# Altium project Parachute deploy board.PrjPcb
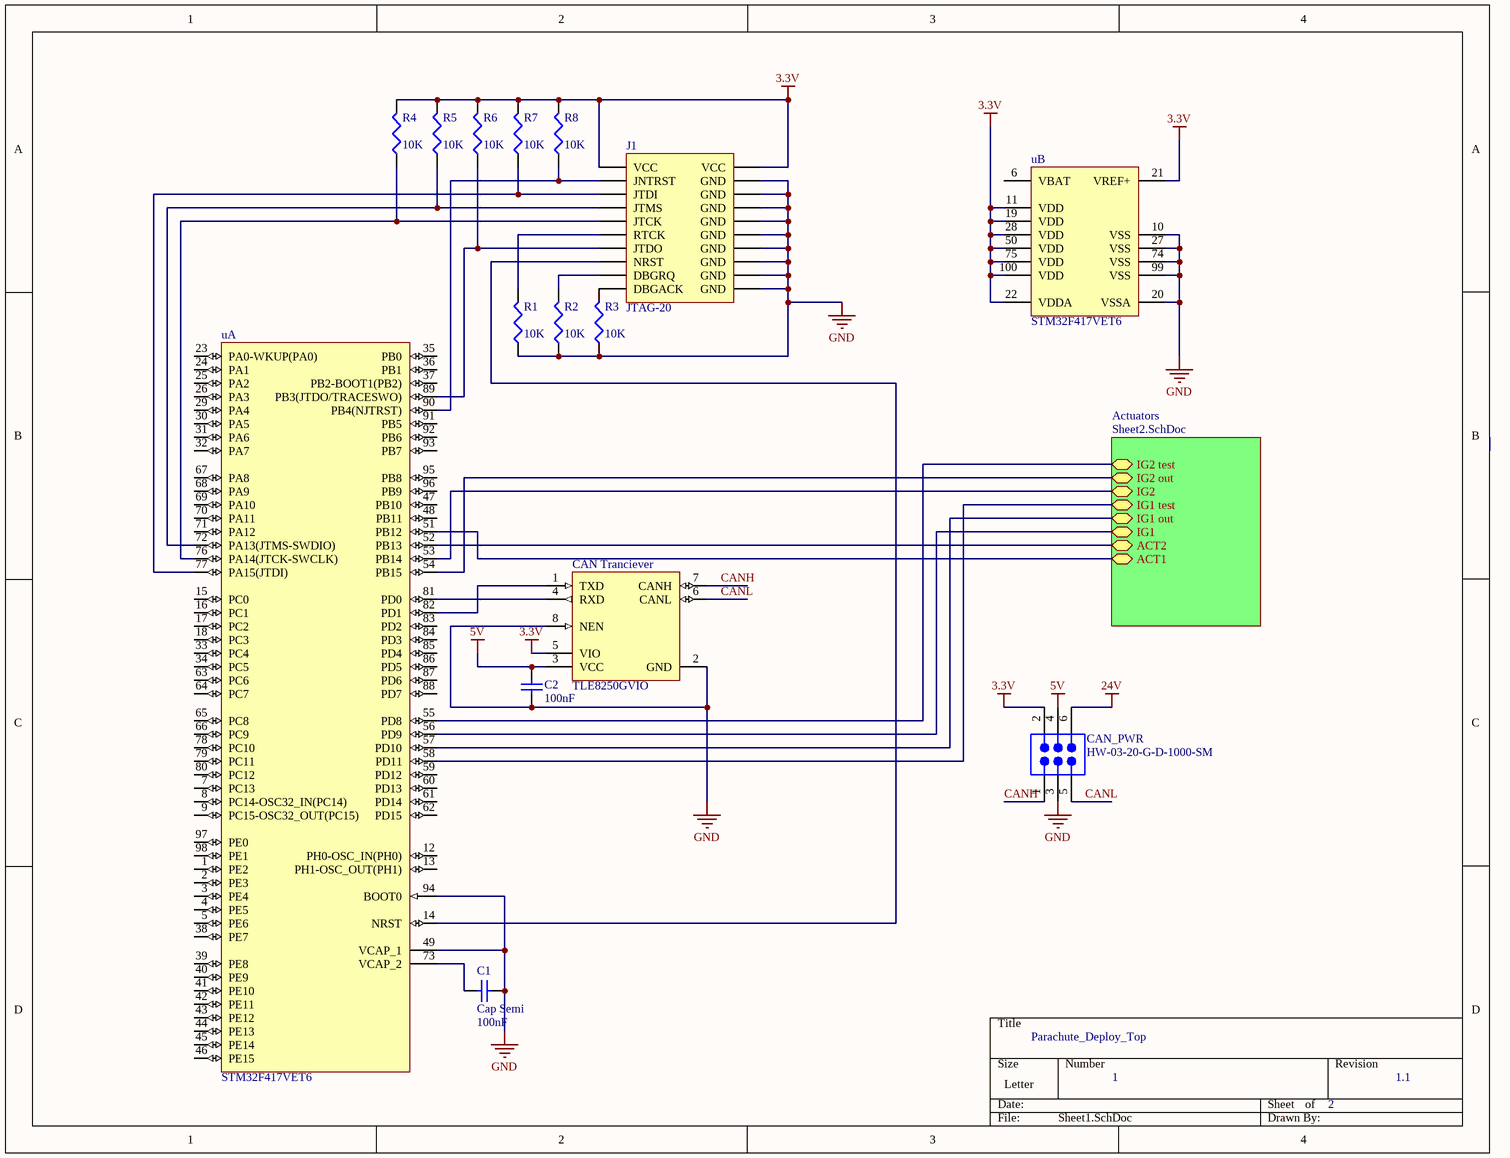
[diagram p0: Sheet1.SchDoc]
2 sheets, 48 parts. Net scope: hierarchical (ports join the sheet entries above them; power ports are global).
Board file: Deploy.PcbDoc
Sheets:
  Sheet1.SchDoc
    Actuators = Sheet2.SchDoc

## Sheet Sheet1.SchDoc: Parachute_Deploy_Top
size Letter; Revision: 1.1; SheetNumber: 1; SheetTotal: 2

### Parts
C1  Cap Semi  value 100nF  [C1206]
C2  value 100nF  [C1206]  (hidden comment: Cap Semi)
CAN_PWR  HW-03-20-G-D-1000-SM  [SMTC-HW-03-20-X-D-1000-SM]
CAN_Tranciever  TLE8250GVIO  [INF-PG-DSO-8-16_N]
J1  JTAG-20  [PCBComponent_1]
R1  value 10K  [J1-0603]  (hidden comment: RTCK PD)
R2  value 10K  [J1-0603]  (hidden comment: DBGRQ PD)
R3  value 10K  [J1-0603]  (hidden comment: DBGACK PD)
R4  value 10K  [J1-0603]  (hidden comment: RTCK PD)
R5  value 10K  [J1-0603]  (hidden comment: RTCK PD)
R6  value 10K  [J1-0603]  (hidden comment: RTCK PD)
R7  value 10K  [J1-0603]  (hidden comment: RTCK PD)
R8  value 10K  [J1-0603]  (hidden comment: RTCK PD)
u  STM32F417VET6  [STM-LQFP100_N]  (parts A,B of 2)

### Sub-sheets
Actuators = Sheet2.SchDoc: IG1 out (bidir), IG1 test (bidir), IG2 (bidir), IG2 test (bidir), IG2 out (bidir), IG1 (bidir), ACT2 (bidir), ACT1 (bidir)

### Nets
3.3V: CAN_PWR.2 CAN_Tranciever.5(VIO) J1.1(VCC) J1.2(VCC) R4.2 R5.2 R6.2 R7.2 R8.2 u.11(VDD) u.19(VDD) u.21(VREF+) u.22(VDDA) u.28(VDD) u.50(VDD) u.75(VDD) u.100(VDD)
5V: C2.2 CAN_PWR.4 CAN_Tranciever.3(VCC)
24V: CAN_PWR.6
GND: C1.2 C2.1 CAN_PWR.3 CAN_Tranciever.2(GND) CAN_Tranciever.8(NEN) J1.4(GND) J1.6(GND) J1.8(GND) J1.10(GND) J1.12(GND) J1.14(GND) J1.16(GND) J1.18(GND) J1.20(GND) R1.1 R2.1 R3.1 u.10(VSS) u.20(VSSA) u.27(VSS) u.49(VCAP_1) u.74(VSS) u.94(BOOT0) u.99(VSS)
CANH: CAN_PWR.1 CAN_Tranciever.7(CANH)
CANL: CAN_PWR.5 CAN_Tranciever.6(CANL)
NetC1_1: C1.1 u.73(VCAP_2)
NetCAN_Tranciever_1: CAN_Tranciever.1(TXD) u.82(PD1)
NetCAN_Tranciever_4: CAN_Tranciever.4(RXD) u.81(PD0)
NetJ1_3: J1.3(JNTRST) R8.1 u.90(PB4(NJTRST))
NetJ1_5: J1.5(JTDI) R7.1 u.77(PA15(JTDI))
NetJ1_7: J1.7(JTMS) R5.1 u.72(PA13(JTMS-SWDIO))
NetJ1_9: J1.9(JTCK) R4.1 u.76(PA14(JTCK-SWCLK))
NetJ1_11: J1.11(RTCK) R1.2
NetJ1_13: J1.13(JTDO) R6.1 u.89(PB3(JTDO/TRACESWO))
NetJ1_15: J1.15(NRST) u.14(NRST)
NetJ1_17: J1.17(DBGRQ) R2.2
NetJ1_19: J1.19(DBGACK) R3.2
NetQm1B_1: u.56(PD9) ; sheet Actuators/IG1
NetQm1C_1: u.58(PD11) ; sheet Actuators/IG1 test
NetQm1C_2: u.57(PD10) ; sheet Actuators/IG1 out
NetQm2B_1: u.53(PB14) ; sheet Actuators/IG2
NetQm2C_1: u.55(PD8) ; sheet Actuators/IG2 test
NetQm2C_2: u.54(PB15) ; sheet Actuators/IG2 out
NetQm3B_1: u.51(PB12) ; sheet Actuators/ACT1
NetQm4B_1: u.52(PB13) ; sheet Actuators/ACT2

Not connected (* = marked no-connect by the designer): u 1(PE2) 2(PE3) 3(PE4) 4(PE5) 5(PE6) 6(VBAT) 7(PC13) 8(PC14-OSC32_IN(PC14)) 9(PC15-OSC32_OUT(PC15)) 12(PH0-OSC_IN(PH0)) 13(PH1-OSC_OUT(PH1)) 15(PC0) 16(PC1) 17(PC2) 18(PC3) 23(PA0-WKUP(PA0)) 24(PA1) 25(PA2) 26(PA3) 29(PA4) 30(PA5) 31(PA6) 32(PA7) 33(PC4) 34(PC5) 35(PB0) 36(PB1) 37(PB2-BOOT1(PB2)) 38(PE7) 39(PE8) 40(PE9) 41(PE10) 42(PE11) 43(PE12) 44(PE13) 45(PE14) 46(PE15) 47(PB10) 48(PB11) 59(PD12) 60(PD13) 61(PD14) 62(PD15) 63(PC6) 64(PC7) 65(PC8) 66(PC9) 67(PA8) 68(PA9) 69(PA10) 70(PA11) 71(PA12) 78(PC10) 79(PC11) 80(PC12) 83(PD2) 84(PD3) 85(PD4) 86(PD5) 87(PD6) 88(PD7) 91(PB5) 92(PB6) 93(PB7) 95(PB8) 96(PB9) 97(PE0) 98(PE1)

### Library data of the parts
C1 C2 = Cap Semi: Capacitor (Semiconductor SIM Model); Published: 8-Jun-2000; LatestRevisionDate: 29-May-2009; LatestRevisionNote: IPC-7351 Footprint Added.; PackageReference: C1206; Publisher: Altium Limited; PackageDescription: Chip Capacitor
CAN_PWR = HW-03-20-G-D-1000-SM: Flexible .025" SQ Board Stacker, Surface Mount, Vertical, -55 to 125 degC, 2.54 mm Pitch, 6-Pin, Male, RoHS; Manufacturer: Samtec; Pitch: 2.54 mm; DatasheetVersion: F-214; PackageVersion: AW, 3/1993; PackageReference: HW-03-20-X-D-1000-SM; PackageDescription: HW Board to Board Assembly; Orientation: Vertical; RoHS: True; Temperature Range: -55 to 125 degC; Mounting Technology: Surface Mount; PartNumber: HW-03-20-G-D-1000-SM; ComponentLink1Description: Datasheet; ComponentLink1URL: http://www.samtec.com/documents/webfiles/pdf/HW_SM.PDF; ComponentLink2Description: Package Specification; ComponentLink2URL: http://www.samtec.com/documents/webfiles/cpdf/HW-XX-XX-XX-X-XXXX-SM-X-XXX-MKT.pdf
CAN_Tranciever = TLE8250GVIO: High Speed CAN-Transceiver, 1 Mbit/s Transmission Rate, PG-DSO-8-16, Reel, Green; Manufacturer: Infineon; Bus Wake-up capability: FALSE; Green: TRUE; Quiescent Current (max.): < 15 uA @ 5V standby; Standards: ISO11898-2; Wake-up inputs: no; DatasheetVersion: Rev. 1.0; PackageVersion: Mar-07; PackageReference: PG-DSO-8-16; PackageDescription: 8-Pin Plastic (Green) Dual Small Outline Package, 4.9 x 3.9 mm Body, 1.27 mm Pitch; Supplier 1: Mouser; Supplier Part Number 1: 726-TLE8250GVIO; Supplier 2: Digi-Key; Supplier Part Number 2: TLE8250GVIO-ND; Group: High Speed; Halogen-free: TRUE; Packing: Reel; Transmission rate max: 1 Mbit/s; Mounting Technology: Surface Mount; PartNumber: TLE8250GVIO; ComponentLink1Description: Manufacturer URL; ComponentLink1URL: http://www.infineon.com/; ComponentLink2Description: Datasheet; ComponentLink2URL: http://www.infineon.com/dgdl/TLE8250GVIO_DS_Rev10.pdf?folderId=db3a30431ed1d7b2011edadb13813703&fileId=db3a30432b57a660012b67ea91880b46&location=en.Products.Automotive_ICs.Automotive_Transceivers.CAN_Transceivers.DATASHEET.TLE8250GVIO_DS_Rev10.pdf; ComponentLink3Description: Package Specification; ComponentLink3URL: http://www.infineon.com/dgdl/TLE7259-2GE_DS_rev12.pdf?folderId=db3a3043163797a6011666d32a0c0de1&fileId=db3a3043163797a6011666d4dbb80de2&location=en.Products.Automotive_ICs.Automotive_Transceivers.LIN_Transceivers.DATASHEET.TLE7259-2GE_DS_rev12.pdf
J1 = HEADER 10X2: 20-pin JTAG header
R1-R8 = Res3: Resistor; Published: 8-Jun-2000; LatestRevisionDate: 29-May-2009; LatestRevisionNote: IPC-7351 Footprint Added.; PackageReference: J1-0603; Publisher: Altium Limited; PackageDescription: Chip Resistor
u = STM32F417VET6: ARM Cortex-M4 32-bit MCU+FPU, 210 DMIPS, 512 kB Flash, 192 kB Internal RAM, 82 I/Os, 100-pin LQFP, -40 to 85 degC, Tray; Manufacturer: STMicroelectronics; D/A Converter: 2x12-bit; FLASH Size (Prog) (kB): 512; I/Os (High Current): 82; Internal RAM Size (kB): 192; Operating Frequency(F) (Processor speed) (MHz): 168; Supply Voltage(Vcc) max (V): 3.6; Supply Voltage(Vcc) min (V): 1.8; DatasheetVersion: Rev. 4; PackageVersion: Rev. 1, 06/2013; PackageReference: LQFP100; PackageDescription: 100-Pin Low Profile Quad Flat Package, 14 x 14 mm Body, 0.5 mm Pitch; Supplier 1: Digi-Key; Supplier Part Number 1: 497-11901-ND; Supplier 2: Farnell; Supplier Part Number 2: 2333307; Supplier 3: Newark; Supplier Part Number 3: 99W9922; Supplier 4: Newark; Supplier Part Number 4: 94T6496; Supplier 5: Mouser; Supplier Part Number 5: 511-STM32F417VET6; Core: ARM Cortex-M4; Packing: Tray; Mounting Technology: Surface Mount; PartNumber: STM32F417VET6; ComponentLink1Description: Manufacturer URL; ComponentLink1URL: http://www.st.com/web/en/home.html; ComponentLink2Description: Datasheet; ComponentLink2URL: http://www.st.com/st-web-ui/static/active/en/resource/technical/document/datasheet/DM00035129.pdf; ComponentLink3Description: Package Specification; ComponentLink3URL: http://www.st.com/st-web-ui/static/active/en/resource/technical/document/data_brief/DM00071938.pdf

## Sheet Sheet2.SchDoc: Ignitors_Actuators
size A; Revision: 1.1; SheetNumber: 2; SheetTotal: 2
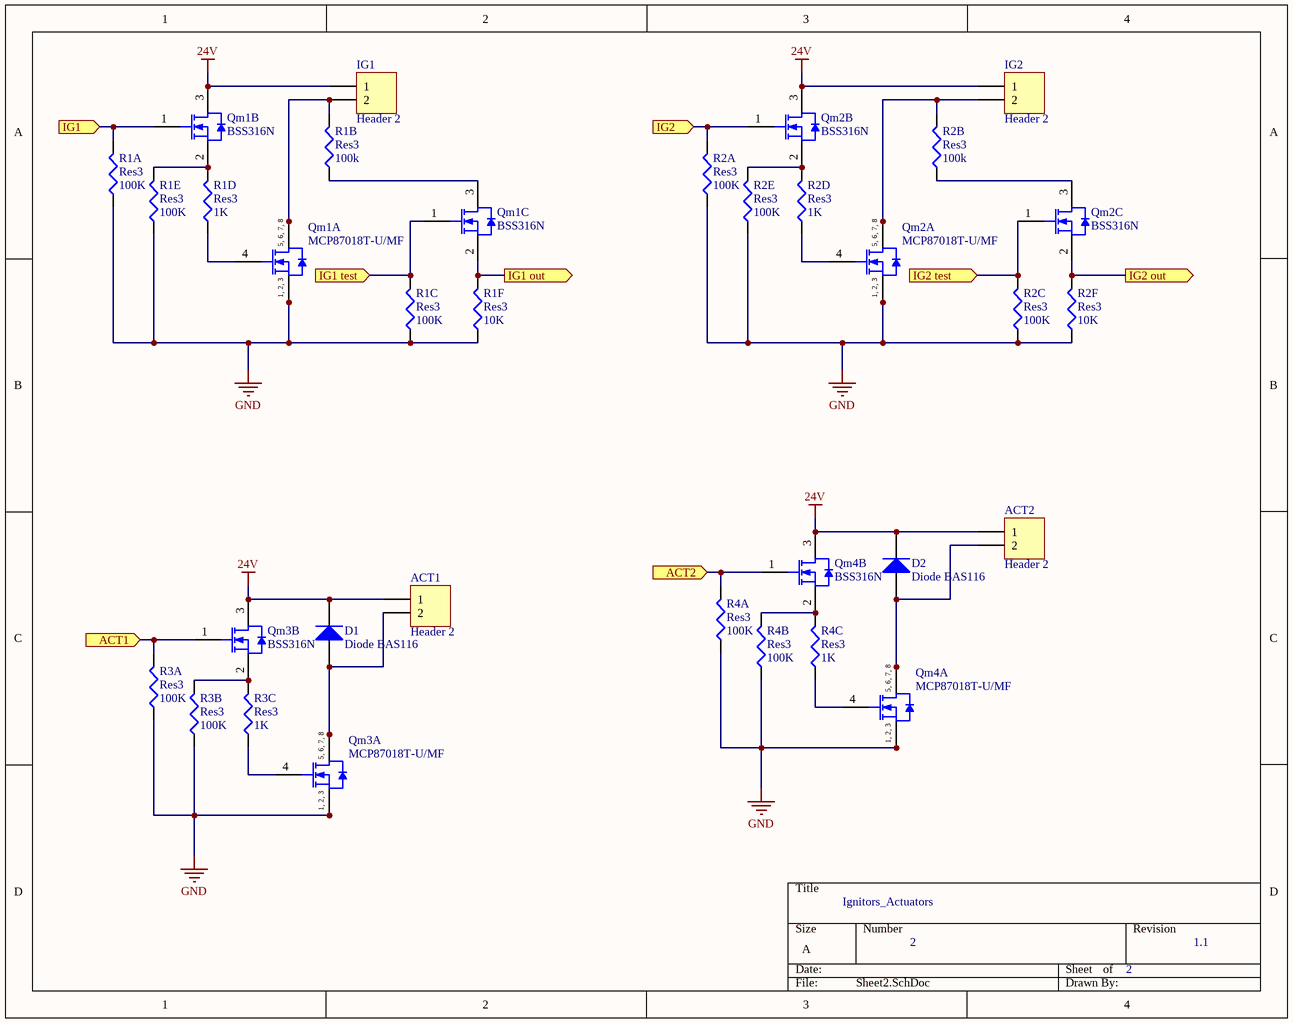
[diagram p1: Sheet2.SchDoc]

### Parts
ACT1  Header 2  [HDR1X2]
ACT2  Header 2  [HDR1X2]
D1  Diode BAS116  [SOT-23_N]
D2  Diode BAS116  [SOT-23_N]
IG1  Header 2  [HDR1X2]
IG2  Header 2  [HDR1X2]
Qm1A  MCP87018T-U/MF  [MCHP-PDFN-MF8_V]
Qm1B  BSS316N  [INF-PG-SOT23_N]
Qm1C  BSS316N  [INF-PG-SOT23_N]
Qm2A  MCP87018T-U/MF  [MCHP-PDFN-MF8_V]
Qm2B  BSS316N  [INF-PG-SOT23_N]
Qm2C  BSS316N  [INF-PG-SOT23_N]
Qm3A  MCP87018T-U/MF  [MCHP-PDFN-MF8_V]
Qm3B  BSS316N  [INF-PG-SOT23_N]
Qm4A  MCP87018T-U/MF  [MCHP-PDFN-MF8_V]
Qm4B  BSS316N  [INF-PG-SOT23_N]
R1A  Res3  value 100K  [J1-0603]
R1B  Res3  value 100k  [J1-0603]
R1C  Res3  value 100K  [J1-0603]
R1D  Res3  value 1K  [J1-0603]
R1E  Res3  value 100K  [J1-0603]
R1F  Res3  value 10K  [J1-0603]
R2A  Res3  value 100K  [J1-0603]
R2B  Res3  value 100k  [J1-0603]
R2C  Res3  value 100K  [J1-0603]
R2D  Res3  value 1K  [J1-0603]
R2E  Res3  value 100K  [J1-0603]
R2F  Res3  value 10K  [J1-0603]
R3A  Res3  value 100K  [J1-0603]
R3B  Res3  value 100K  [J1-0603]
R3C  Res3  value 1K  [J1-0603]
R4A  Res3  value 100K  [J1-0603]
R4B  Res3  value 100K  [J1-0603]
R4C  Res3  value 1K  [J1-0603]

### Ports
ACT1 (in), ACT2 (in), IG1 (in), IG1 out (out), IG1 test (in), IG2 (in), IG2 out (out), IG2 test (in)

### Nets
24V: ACT1.1 ACT2.1 D1.3(K) D2.3(K) IG1.1 IG2.1 Qm1B.3(DRAIN) Qm2B.3(DRAIN) Qm3B.3(DRAIN) Qm4B.3(DRAIN)
GND: Qm1A.1(S) Qm1A.2(S) Qm1A.3(S) Qm2A.1(S) Qm2A.2(S) Qm2A.3(S) Qm3A.1(S) Qm3A.2(S) Qm3A.3(S) Qm4A.1(S) Qm4A.2(S) Qm4A.3(S) R1A.1 R1C.1 R1E.1 R1F.1 R2A.1 R2C.1 R2E.1 R2F.1 R3A.1 R3B.1 R4A.1 R4B.1
NetACT1_2: ACT1.2 D1.1(A) Qm3A.5(D) Qm3A.6(D) Qm3A.7(D) Qm3A.8(D)
NetACT2_2: ACT2.2 D2.1(A) Qm4A.5(D) Qm4A.6(D) Qm4A.7(D) Qm4A.8(D)
NetIG1_2: IG1.2 Qm1A.5(D) Qm1A.6(D) Qm1A.7(D) Qm1A.8(D) R1B.2
NetIG2_2: IG2.2 Qm2A.5(D) Qm2A.6(D) Qm2A.7(D) Qm2A.8(D) R2B.2
NetQm1A_4: Qm1A.4(G) R1D.1
NetQm1B_1: Qm1B.1(GATE) R1A.2 ; port IG1
NetQm1B_2: Qm1B.2(SOURCE) R1D.2 R1E.2
NetQm1C_1: Qm1C.1(GATE) R1C.2 ; port IG1 test
NetQm1C_2: Qm1C.2(SOURCE) R1F.2 ; port IG1 out
NetQm1C_3: Qm1C.3(DRAIN) R1B.1
NetQm2A_4: Qm2A.4(G) R2D.1
NetQm2B_1: Qm2B.1(GATE) R2A.2 ; port IG2
NetQm2B_2: Qm2B.2(SOURCE) R2D.2 R2E.2
NetQm2C_1: Qm2C.1(GATE) R2C.2 ; port IG2 test
NetQm2C_2: Qm2C.2(SOURCE) R2F.2 ; port IG2 out
NetQm2C_3: Qm2C.3(DRAIN) R2B.1
NetQm3A_4: Qm3A.4(G) R3C.1
NetQm3B_1: Qm3B.1(GATE) R3A.2 ; port ACT1
NetQm3B_2: Qm3B.2(SOURCE) R3B.2 R3C.2
NetQm4A_4: Qm4A.4(G) R4C.1
NetQm4B_1: Qm4B.1(GATE) R4A.2 ; port ACT2
NetQm4B_2: Qm4B.2(SOURCE) R4B.2 R4C.2

### Notes on the sheet
- (in symbol MCP87018T-U/MF) 5, 6, 7, 8; 1, 2, 3

### Library data of the parts
ACT1 ACT2 IG1 IG2 = Header 2: Header, 2-Pin; LatestRevisionDate: 17-Jul-2002; LatestRevisionNote: Re-released for DXP Platform.; Publisher: Altium Limited
D1 D2 = Diode BAS116: Silicon Low Leakage Diode; Note: Pin 2 is not connected and not drawn.; Published: 21-Mar-2003; LatestRevisionDate: 29-May-2009; LatestRevisionNote: IPC-7351 Footprint Added.; DatasheetVersion: Oct-1999; PackageVersion: Sep-2001; PackageReference: SOT-23; Publisher: Altium Limited; PackageDescription: 3-Pin SOT-23 Package 0.95 mm Pitch, 2.5 mm Lead Span; ComponentLink1Description: Manufacturer Link; ComponentLink1URL: http://www.infineon.com/; ComponentLink2Description: Datasheet; ComponentLink2URL: http://www.infineon.com/upload/Document/cmc_upload/documents/080/656/bas116series.pdf
Qm1A Qm2A Qm3A Qm4A = MCP87018T-U/MF: High-Speed N-Channel Power MOSFET, Single Configuration, 25 V, -55 to 150 degC, 8-pin PDFN (MF8), Tape and Reel; Manufacturer: Microchip; DatasheetVersion: Rev. A; PackageVersion: C04-188B; PackageReference: PDFN-MF8; PackageDescription: 8-Lead Power Dual Flatpack No Lead Package, 5 x 6 mm Body, 1.27 mm Pitch; Supplier 1: Digi-Key; Supplier Part Number 1: MCP87018T-U/MF-ND; Supplier 2: Newark; Supplier Part Number 2: 53W9402; Supplier 3: Mouser; Supplier Part Number 3: 579-MCP87018T-U/MF; Mounting Technology: Surface Mount; PartNumber: MCP87018T-U/MF; ComponentLink1Description: Manufacturer URL; ComponentLink1URL: http://www.microchip.com; ComponentLink2Description: Datasheet; ComponentLink2URL: http://ww1.microchip.com/downloads/en/DeviceDoc/22329A.pdf; ComponentLink3Description: Package Specification; ComponentLink3URL: http://www.microchip.com/stellent/groups/techpub_sg/documents/packagingspec/en012702.pdf; ComponentLink4Description: Product URL; ComponentLink4URL: http://www.microchip.com/MCP87018
Qm1B Qm1C Qm2B Qm2C Qm3B Qm4B = BSS316N: N-Channel OptiMOS 2 Small-Signal-Transistor, 30 V VDS, 1.4 A ID, -55 to 150 degC, PG-SOT23, Reel, Green; Manufacturer: Infineon; Green: TRUE; ID (max): 1.4 A; IDpuls (max): 5.6 A; Ptot (max): 0.5 W; QG: 0.6 nC; RDS (on) (max): 160 mOhm; RDS (on) (max) (@4.5V): 280 mOhm; RthJA (max): 250 K/W; VDS (max): 30 V; VGS(th) (max): 2 V; VGS(th) (min): 1.2 V; DatasheetVersion: Rev. 2.3; PackageVersion: Apr-08; PackageReference: PG-SOT23; PackageDescription: 3-Pin Small Outline Transistor Package, 2.9 x 1.3 mm Body, 0.95 mm Pitch; Halogen-free: TRUE; Packing: Reel; Mounting Technology: Surface Mount; PartNumber: BSS316N; ComponentLink1Description: Manufacturer URL; ComponentLink1URL: http://www.infineon.com/; ComponentLink2Description: Datasheet; ComponentLink2URL: http://www.infineon.com/dgdl/BSS316N_Rev2.3.pdf?folderId=db3a3043156fd573011622e10b5c1f67&fileId=db3a304330f686060130ff7ee4b07f16; ComponentLink3Description: Package Specification; ComponentLink3URL: http://www.infineon.com/dgdl/SOT23-Package_Overview.pdf?folderId=db3a30431936bc4b0119532290053c66&fileId=db3a30431936bc4b0119533468123c85
R1A R1B R1C R1D R1E R1F R2A R2B R2C R2D R2E R2F R3A R3B R3C R4A R4B R4C = Res3: Resistor; Published: 8-Jun-2000; LatestRevisionDate: 29-May-2009; LatestRevisionNote: IPC-7351 Footprint Added.; PackageReference: J1-0603; Publisher: Altium Limited; PackageDescription: Chip Resistor

## Nets that join several sheets
24V: Sheet1 (CAN_PWR.6), Sheet2 (10 pins)
GND: Sheet1 (24 pins), Sheet2 (24 pins)
NetQm1B_1: Sheet1 (u.56), Sheet2 (Qm1B.1 R1A.2)
NetQm1C_1: Sheet1 (u.58), Sheet2 (Qm1C.1 R1C.2)
NetQm1C_2: Sheet1 (u.57), Sheet2 (Qm1C.2 R1F.2)
NetQm2B_1: Sheet1 (u.53), Sheet2 (Qm2B.1 R2A.2)
NetQm2C_1: Sheet1 (u.55), Sheet2 (Qm2C.1 R2C.2)
NetQm2C_2: Sheet1 (u.54), Sheet2 (Qm2C.2 R2F.2)
NetQm3B_1: Sheet1 (u.51), Sheet2 (Qm3B.1 R3A.2)
NetQm4B_1: Sheet1 (u.52), Sheet2 (Qm4B.1 R4A.2)